# Altium project Sensorbox.PrjPCB (part 2 of 2)

## Sheet GSM.SchDoc: Sheet
size 420 x 297 mm; DocumentNumber: 1; SheetNumber: 1; SheetTotal: 8
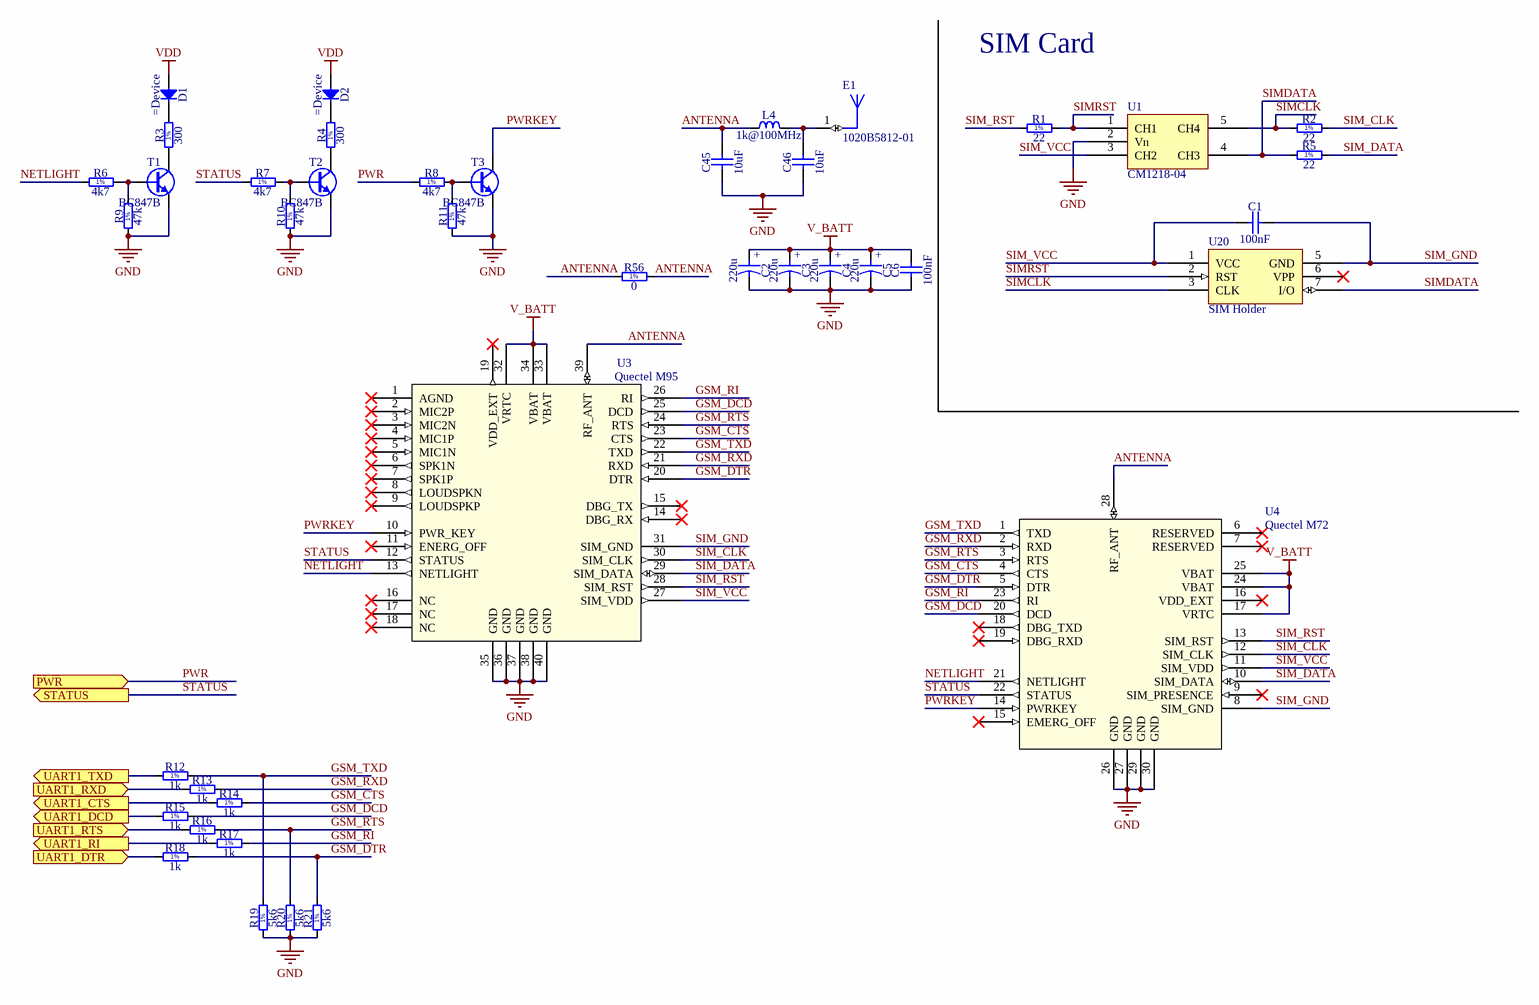
[diagram p6: GSM.SchDoc]

### Parts
C1  100nF  [CAPC1608X87N]
C2  220u  [CAPMP7343X310N]
C3  220u  [CAPMP7343X310N]
C4  220u  [CAPMP7343X310N]
C5  220u  [CAPMP7343X310N]
C6  100nF  [CAPC1608X87N]
C45  10uF  [CAPC1608X87N]
C46  10uF  [CAPC1608X87N]
D1  (no value)  [LED_DIODE_0603]
D2  (no value)  [LED_DIODE_0603]
E1  1020B5812-01  [ANT27.3X7.9]
L4  1k@100MHz  [INDC1608X100N]
R1  22  [RESC1608X55N]
R2  22  [RESC1608X55N]
R3  300  [RESC1608X55N]
R4  300  [RESC1608X55N]
R5  22  [RESC1608X55N]
R6  4k7  [RESC1608X55N]
R7  4k7  [RESC1608X55N]
R8  4k7  [RESC1608X55N]
R9  47k  [RESC1608X55N]
R10  47k  [RESC1608X55N]
R11  47k  [RESC1608X55N]
R12  1k  [RESC1608X55N]
R13  1k  [RESC1608X55N]
R14  1k  [RESC1608X55N]
R15  1k  [RESC1608X55N]
R16  1k  [RESC1608X55N]
R17  1k  [RESC1608X55N]
R18  1k  [RESC1608X55N]
R19  5k6  [RESC1608X55N]
R20  5k6  [RESC1608X55N]
R21  5k6  [RESC1608X55N]
R56  0  [RESC1608X55N]
T1  BC847B  [SOT95P230X110-3N]
T2  BC847B  [SOT95P230X110-3N]
T3  BC847B  [SOT95P230X110-3N]
U1  CM1218-04  [ESD PROTECTOR]
U3  Quectel M95  [QUECTEL M95]
U4  Quectel M72  [Quectel M72 GSM Module]
U20  SIM Holder  [CARD-SIMEE8C15]

### Ports
PWR (in), STATUS (out), UART1_CTS (out), UART1_DCD (out), UART1_DTR (in), UART1_RI (out), UART1_RTS (in), UART1_RXD (in), UART1_TXD (out)

### Nets
GND: C2.2 C3.2 C4.2 C5.2 C6.1 C45.1 C46.1 R9.1 R10.1 R11.1 R19.1 R20.1 R21.1 T1.2(E) T2.2(E) T3.2(E) U1.2(Vn) U3.35(GND) U3.36(GND) U3.37(GND) U3.38(GND) U3.40(GND) U4.26(GND) U4.27(GND) U4.29(GND) U4.30(GND)
V_BATT: C2.1 C3.1 C4.1 C5.1 C6.2 U3.32(VRTC) U3.33(VBAT) U3.34(VBAT) U4.17(VRTC) U4.24(VBAT) U4.25(VBAT)
VDD: D1.2(A) D2.2(A)
ANTENNA: C45.2 L4.1 R56.1 R56.2 U3.39(RF_ANT) U4.28(RF_ANT)
GSM_1: R12.1 ; port UART1_TXD
GSM_2: R13.1 ; port UART1_RXD
GSM_3: R14.1 ; port UART1_CTS
GSM_4: R15.1 ; port UART1_DCD
GSM_5: R17.1 ; port UART1_RI
GSM_6: R18.1 ; port UART1_DTR
GSM_7: R16.1 ; port UART1_RTS
GSM_CTS: R14.2 U3.23(CTS) U4.4(CTS)
GSM_DCD: R15.2 U3.25(DCD) U4.20(DCD)
GSM_DTR: R18.2 R21.2 U3.20(DTR) U4.5(DTR)
GSM_RI: R17.2 U3.26(RI) U4.23(RI)
GSM_RTS: R16.2 R20.2 U3.24(RTS) U4.3(RTS)
GSM_RXD: R13.2 U3.21(RXD) U4.2(RXD)
GSM_TXD: R12.2 R19.2 U3.22(TXD) U4.1(TXD)
NETLIGHT: R6.1 U3.13(NETLIGHT) U4.21(NETLIGHT)
PWR: R8.1 ; port PWR  [project net GSM_8]
PWRKEY: T3.3(C) U3.10(PWR_KEY) U4.14(PWRKEY)
SIM_CLK: R2.2 U3.30(SIM_CLK) U4.12(SIM_CLK)
SIM_DATA: R5.2 U3.29(SIM_DATA) U4.10(SIM_DATA)
SIM_GND: C1.2 U3.31(SIM_GND) U4.8(SIM_GND) U20.5(GND)
SIM_RST: R1.1 U3.28(SIM_RST) U4.13(SIM_RST)
SIM_VCC: C1.1 U1.3(CH2) U3.27(SIM_VDD) U4.11(SIM_VDD) U20.1(VCC)
SIMCLK: R2.1 U1.5(CH4) U20.3(CLK)
SIMDATA: R5.1 U1.4(CH3) U20.7(I/O)
SIMRST: R1.2 U1.1(CH1) U20.2(RST)
STATUS: R7.1 U3.12(STATUS) U4.22(STATUS) ; port STATUS  [project net GSM_9]
NetC46_2: C46.2 E1.1(FEED) L4.2
NetD1_1: D1.1(C) R3.2
NetD2_1: D2.1(C) R4.2
NetR3_1: R3.1 T1.3(C)
NetR4_1: R4.1 T2.3(C)
NetR6_2: R6.2 R9.2 T1.1(B)
NetR7_2: R7.2 R10.2 T2.1(B)
NetR8_2: R8.2 R11.2 T3.1(B)

Not connected (* = marked no-connect by the designer): U3 1(AGND)* 2(MIC2P)* 3(MIC2N)* 4(MIC1P)* 5(MIC1N)* 6(SPK1N)* 7(SPK1P)* 8(LOUDSPKN)* 9(LOUDSPKP)* 11(ENERG_OFF)* 14(DBG_RX)* 15(DBG_TX)* 16(NC)* 17(NC)* 18(NC)* 19(VDD_EXT)*; U4 6(RESERVED)* 7(RESERVED)* 9(SIM_PRESENCE)* 15(EMERG_OFF)* 16(VDD_EXT)* 18(DBG_TXD)* 19(DBG_RXD)*; U20 6(VPP)*

### Notes on the sheet
- SIM Card
- Project/Equipment
- Document
- Sensorbox
- Designer
- Drawn by
- Check.by
- Copyright Creotech Instruments SA 2014.
  This documentation describes Open Hardware and is licensed under the CERN OHL v.1.1. You may redistribute and modify this documentation under the terms of the CERN OHL v.1.1. (http://ohwr.org/CERNOHL). This documentation is distributed WITHOUT ANY EXPRESS OR IMPLIED WARRANTY, INCLUDING OF MERCHANTABILITY, SATISFACTORY QUALITY AND FITNESS FOR A PARTICULAR PURPOSE. Please see the CERN OHL v.1.1 for applicable conditions.
- CTI
- Creotech Instruments S.A.
- File
- Last Mod.
- Print Date
- Sheet
- Size
- A3
- of
- Rev
- (in symbol Capacitor - polarized) +
- (in symbol R0603_0R_JUMPER) 1%
- (in symbol R0603_1K_1%_0.1W_100PPM) 1%
- (in symbol R0603_4K7_1%_0.1W_100PPM) 1%
- (in symbol R0603_5K6_1%_0.1W_100PPM) 1%
- (in symbol R0603_22R_1%_0.1W_100PPM) 1%
- (in symbol R0603_47K_1%_0.1W_100PPM) 1%
- (in symbol R0603_300R_1%_0.1W_100PPM) 1%

### Library data of the parts
C1 C6 = CC0603_100NF_50V_10%_X7R: Non-polarised capacitor; Part Description: SMD Multilayer Chip Ceramic Capacitor; Manufacturer: GENERIC; Manufacturer1 Part Number: 223858615649; Voltage: 50V; TC: X7R; Tolerance: ±10%; Table: Capacitors SMD; Part Number: CC0603_100NF_50V_10%_X7R; Component Kind: Standard; Component Type: Standard; Pin Count: 2; Value: 100nF; Status: Preferred; Manufacturer Part Number: CC0603_100NF_50V_10%_X7R; Case: 0603; Mounted: Yes; Socket: No; SMD: Yes; Manufacturer1 Example: PHYCOMP; Manufacturer1 ComponentHeight: 0.87mm; HelpURL: \\cern.ch\dfs\Applications\Altium\Datasheets\CC0603_X7R_PHYCOMP.pdf; Author: CERN DEM JLC; CreateDate: 2007-12-03; LatestRevisionDate: 2007-12-03
C2-C5 = Capacitor - polarized: KEMET T530D
C45 C46 = CC0603_10UF_6.3V_20%_X5R: Non-polarised capacitor; Part Description: SMD Multilayer Chip Ceramic Capacitor; Manufacturer: GENERIC; Manufacturer1 Part Number: C0603C106M9PAC; Voltage: 6.3V; TC: X5R; Tolerance: ±20%; Table: Capacitors SMD; Part Number: CC0603_10UF_6.3V_20%_X5R; Component Kind: Standard; Component Type: Standard; Pin Count: 2; Value: 10uF; Status: Preferred; Manufacturer Part Number: CC0603_10uF_6.3V_20%_X5R; Case: 0603; Mounted: Yes; Socket: No; SMD: Yes; Manufacturer1 Example: KEMET; Manufacturer1 ComponentHeight: 0.95mm; HelpURL: \\cern.ch\dfs\Applications\Altium\Datasheets\CC0603_X5R_KEMET.pdf; Author: CERN DEM JLC; CreateDate: 2007-12-03; LatestRevisionDate: 2007-12-03
D1 D2 = Diode
E1 = 1020B5812-01: Flavus GSM Snap-In Antenna, 800/900/1800/1900 MHz, 0.8mm PCB Thickness; PCB_Layout: Complies with manufacturer's recommendation.; Published: 30-May-2008; DatasheetVersion: AE030090-C; PackageVersion: Feb-2007; PackageReference: ANT27.3X7.9; Publisher: Altium Limited; PackageDescription: Snap-In Antenna, Plastic; Body 27.3 x 7.9 mm (LxW); ComponentLink1Description: Manufacturer Link; ComponentLink1URL: http://www.antenova.com/; ComponentLink2Description: Datasheet; ComponentLink2URL: http://www.antenova.com/?id=855&pv=1&lang=1
L4 = IND0603_WURTH_74279266: Inductor; Part Description: SMD EMI Suppression Chip Bead Ferrite (WE-CBF Serie); Manufacturer: WURTH ELEKTRONIK; Power: 200mA; Resistance: 0.6R; Tolerance: ±25%; Table: Inductors SMD; Part Number: IND0603_WURTH_74279266; Component Kind: Standard; Component Type: Standard; Pin Count: 2; Value: 1k@100MHz; Status: None; Manufacturer Part Number: 74279266; Case: 0603; Mounted: Yes; Socket: No; SMD: Yes; ComponentHeight: 1mm; HelpURL: \\cern.ch\dfs\Applications\Altium\Datasheets\IND0603_WURTH_74279266.pdf; Author: CERN DEM JLC; CreateDate: 2011-03-08; LatestRevisionDate: 2011-03-08
R1 R2 R5 = R0603_22R_1%_0.1W_100PPM: Resistor - 1%; Part Description: General Purpose Thick Film Chip Resistor; Manufacturer: GENERIC; Manufacturer1 Part Number: NRC06F22R0TRF; Power: 0.1W; TC: ±100ppm/°C; Table: Resistors SMD; Part Number: R0603_22R_1%_0.1W_100PPM; Component Kind: Standard; Component Type: Standard; Pin Count: 2; Value: 22; Status: Preferred; Tolerance: ±1%; Manufacturer Part Number: R0603_22R_1%_0.1W_100PPM; Case: 0603; Mounted: Yes; Socket: No; SMD: Yes; Manufacturer1 Example: NIC COMPONENT; Manufacturer1 ComponentHeight: 0.55mm; HelpURL: \\cern.ch\dfs\Applications\Altium\Datasheets\R0603_NIC_NRC.pdf; Author: CERN DEM JLC; CreateDate: 2007-12-03; LatestRevisionDate: 2008-03-13
R3 R4 = R0603_300R_1%_0.1W_100PPM: Resistor - 1%; Part Description: General Purpose Thick Film Chip Resistor; Manufacturer: GENERIC; Manufacturer1 Part Number: NRC06F3000TRF; Power: 0.1W; TC: ±100ppm/°C; Table: Resistors SMD; Part Number: R0603_300R_1%_0.1W_100PPM; Component Kind: Standard; Component Type: Standard; Pin Count: 2; Value: 300; Status: Preferred; Tolerance: ±1%; Manufacturer Part Number: R0603_300R_1%_0.1W_100PPM; Case: 0603; Mounted: Yes; Socket: No; SMD: Yes; Manufacturer1 Example: NIC COMPONENT; Manufacturer1 ComponentHeight: 0.55mm; HelpURL: \\cern.ch\dfs\Applications\Altium\Datasheets\R0603_NIC_NRC.pdf; Author: CERN DEM JLC; CreateDate: 2007-12-03; LatestRevisionDate: 2008-03-13
R6-R8 = R0603_4K7_1%_0.1W_100PPM: Resistor - 1%; Part Description: General Purpose Thick Film Chip Resistor; Manufacturer: GENERIC; Manufacturer1 Part Number: NRC06F4701TRF; Power: 0.1W; TC: ±100ppm/°C; Table: Resistors SMD; Part Number: R0603_4K7_1%_0.1W_100PPM; Component Kind: Standard; Component Type: Standard; Pin Count: 2; Value: 4k7; Status: Preferred; Tolerance: ±1%; Manufacturer Part Number: R0603_4K7_1%_0.1W_100PPM; Case: 0603; Mounted: Yes; Socket: No; SMD: Yes; Manufacturer1 Example: NIC COMPONENT; Manufacturer1 ComponentHeight: 0.55mm; HelpURL: \\cern.ch\dfs\Applications\Altium\Datasheets\R0603_NIC_NRC.pdf; Author: CERN DEM JLC; CreateDate: 2007-12-03; LatestRevisionDate: 2008-03-13
R9-R11 = R0603_47K_1%_0.1W_100PPM: Resistor - 1%; Part Description: General Purpose Thick Film Chip Resistor; Manufacturer: GENERIC; Manufacturer1 Part Number: NRC06F4702TRF; Power: 0.1W; TC: ±100ppm/°C; Table: Resistors SMD; Part Number: R0603_47K_1%_0.1W_100PPM; Component Kind: Standard; Component Type: Standard; Pin Count: 2; Value: 47k; Status: Preferred; Tolerance: ±1%; Manufacturer Part Number: R0603_47K_1%_0.1W_100PPM; Case: 0603; Mounted: Yes; Socket: No; SMD: Yes; Manufacturer1 Example: NIC COMPONENT; Manufacturer1 ComponentHeight: 0.55mm; HelpURL: \\cern.ch\dfs\Applications\Altium\Datasheets\R0603_NIC_NRC.pdf; Author: CERN DEM JLC; CreateDate: 2007-12-03; LatestRevisionDate: 2008-03-13
R12-R18 = R0603_1K_1%_0.1W_100PPM: Resistor - 1%; Part Description: General Purpose Thick Film Chip Resistor; Manufacturer: GENERIC; Manufacturer1 Part Number: NRC06F1001TRF; Power: 0.1W; TC: ±100ppm/°C; Table: Resistors SMD; Part Number: R0603_1K_1%_0.1W_100PPM; Component Kind: Standard; Component Type: Standard; Pin Count: 2; Value: 1k; Status: Preferred; Tolerance: ±1%; Manufacturer Part Number: R0603_1K_1%_0.1W_100PPM; Case: 0603; Mounted: Yes; Socket: No; SMD: Yes; Manufacturer1 Example: NIC COMPONENT; Manufacturer1 ComponentHeight: 0.55mm; HelpURL: \\cern.ch\dfs\Applications\Altium\Datasheets\R0603_NIC_NRC.pdf; Author: CERN DEM JLC; CreateDate: 2007-12-03; LatestRevisionDate: 2008-03-13
R19-R21 = R0603_5K6_1%_0.1W_100PPM: Resistor - 1%; Part Description: General Purpose Thick Film Chip Resistor; Manufacturer: GENERIC; Manufacturer1 Part Number: NRC06F5601TRF; Power: 0.1W; TC: ±100ppm/°C; Table: Resistors SMD; Part Number: R0603_5K6_1%_0.1W_100PPM; Component Kind: Standard; Component Type: Standard; Pin Count: 2; Value: 5k6; Status: Preferred; Tolerance: ±1%; Manufacturer Part Number: R0603_5K6_1%_0.1W_100PPM; Case: 0603; Mounted: Yes; Socket: No; SMD: Yes; Manufacturer1 Example: NIC COMPONENT; Manufacturer1 ComponentHeight: 0.55mm; HelpURL: \\cern.ch\dfs\Applications\Altium\Datasheets\R0603_NIC_NRC.pdf; Author: CERN DEM JLC; CreateDate: 2007-12-03; LatestRevisionDate: 2008-03-13
R56 = R0603_0R_JUMPER: Resistor - 1%; Part Description: 1A (0.05R Max DC Resistance) Zero Ohm Jumper; Manufacturer: GENERIC; Manufacturer1 Part Number: NRC06Z0; Table: Resistors SMD; Part Number: R0603_0R_JUMPER; Component Kind: Standard; Component Type: Standard; Pin Count: 2; Value: 0; Status: Preferred; Manufacturer Part Number: R0603_0R_JUMPER; Case: 0603; Mounted: Yes; Socket: No; SMD: Yes; Manufacturer1 Example: NIC COMPONENT; Manufacturer1 ComponentHeight: 0.55mm; HelpURL: \\cern.ch\dfs\Applications\Altium\Datasheets\R0603_NIC_NRC.pdf; Author: CERN DEM JLC; CreateDate: 2007-12-03; LatestRevisionDate: 2008-03-13
T1-T3 = BC847B: NPN Transistor; Part Description: 45V, 100mA NPN general-purpose transistors; Manufacturer: NXP SEMICONDUCTORS; Table: Transistors; Part Number: BC847B; Component Kind: Standard; Component Type: Standard; Device: BC847B; PackageDescription: SOT23, 3 pin, Pitch 0.95mm - 1.3mm W X 2.9mm L X 1.1mm H, IPC Medium Density; Manufacturer Part Number: BC847B; Pin Count: 3; Case: SOT23-3; Mounted: Yes; Socket: No; SMD: Yes; ComponentHeight: 1.1mm; HelpURL: \\cern.ch\dfs\Applications\Altium\Datasheets\BC847B.pdf; Author: CERN DEM JLC; CreateDate: 2011-06-14; LatestRevisionDate: 2011-06-14
U1 = CM1218-04 ESD_Protector SOT23-5 Package: ESD_Protector SOT23-5 Package
U3 = Quectel M95: GSM Module
U4 = Quectel M72: GSM Module
U20 = SIM Holder: 6-pin SIM Holder

## Sheet Display.SchDoc: Display
size 420 x 297 mm; DocumentNumber: 8; SheetNumber: 8; SheetTotal: 8
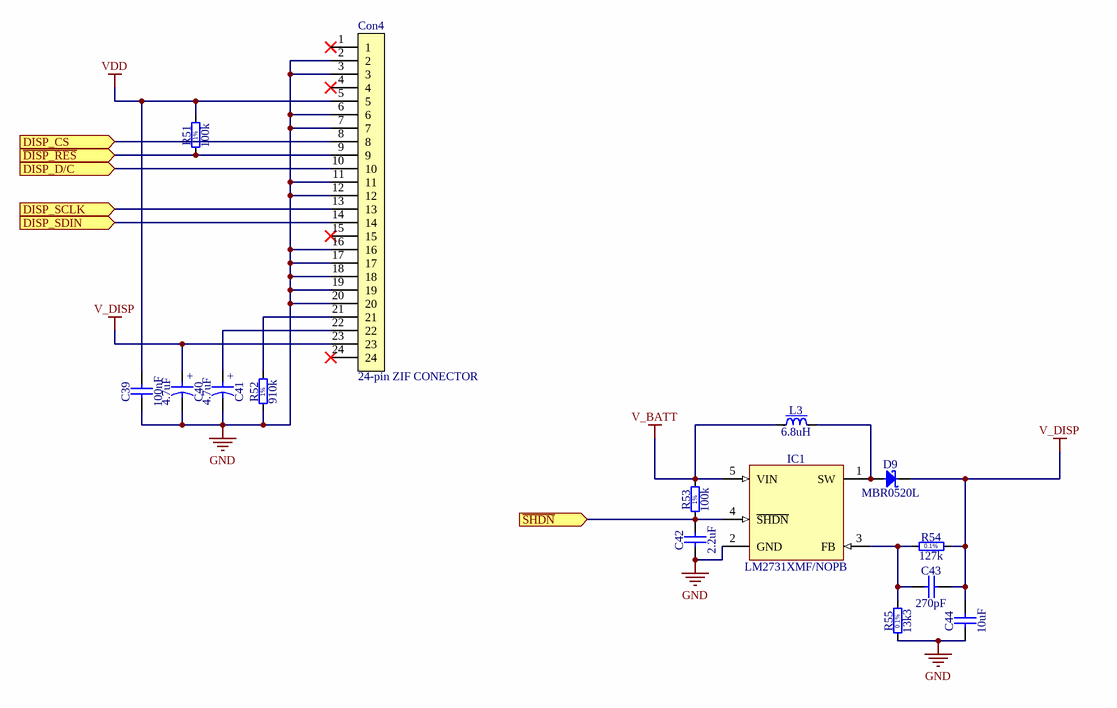
[diagram p7: Display.SchDoc]

### Parts
C39  100nF  [CAPC1608X87N]
C40  4.7uF  [CAPMP3216X180N]
C41  4.7uF  [CAPMP3216X180N]
C42  2.2uF  [CAPC1608X90N]
C43  270pF  [CAPC1608X87N]
C44  10uF  [CAPC1608X87N]
Con4  24-pin ZIF CONECTOR  [CviLux CF20 ZIFNZ0224CV]
D9  MBR0520L  [SOD3816X118N]
IC1  LM2731XMF/NOPB  [SOT95P284X122-5N]
L3  6.8uH  [IND_COILCRAFT_DO3316]
R51  100k  [RESC1608X55N]
R52  910k  [RESC1608X55N]
R53  100k  [RESC1608X55N]
R54  127k  [RESC1608X55N]
R55  13k3  [RESC1608X55N]

### Ports
DISP_CS (in), DISP_D/C (in), DISP_SCLK (in), DISP_SDIN (in), ~{DISP_RES} (in), ~{SHDN} (in)

### Nets
GND: C39.1 C40.2 C41.2 C42.1 C44.1 Con4.2 Con4.3 Con4.6 Con4.7 Con4.11 Con4.12 Con4.16 Con4.17 Con4.18 Con4.19 Con4.20 IC1.2(GND) R52.1 R55.1
V_BATT: IC1.5(VIN) L3.1 R53.2
V_DISP: C40.1 C43.2 C44.2 Con4.23 D9.1(C) R54.2
VDD: C39.2 Con4.5 R51.2
NetC41_1: C41.1 Con4.22
NetC42_2: C42.2 IC1.4(~{SHDN}) R53.1 ; port ~{SHDN}
NetC43_1: C43.1 IC1.3(FB) R54.1 R55.2
NetCon4_8: Con4.8 ; port DISP_CS
NetCon4_9: Con4.9 R51.1 ; port ~{DISP_RES}
NetCon4_10: Con4.10 ; port DISP_D/C
NetCon4_13: Con4.13 ; port DISP_SCLK
NetCon4_14: Con4.14 ; port DISP_SDIN
NetCon4_21: Con4.21 R52.2
NetD9_2: D9.2(A) IC1.1(SW) L3.2

Not connected (* = marked no-connect by the designer): Con4 1* 4* 15* 24*

### Notes on the sheet
- Project/Equipment
- Document
- Sensorbox
- Designer
- Drawn by
- Check.by
- Copyright Creotech Instruments SA 2014.
  This documentation describes Open Hardware and is licensed under the CERN OHL v.1.1. You may redistribute and modify this documentation under the terms of the CERN OHL v.1.1. (http://ohwr.org/CERNOHL). This documentation is distributed WITHOUT ANY EXPRESS OR IMPLIED WARRANTY, INCLUDING OF MERCHANTABILITY, SATISFACTORY QUALITY AND FITNESS FOR A PARTICULAR PURPOSE. Please see the CERN OHL v.1.1 for applicable conditions.
- CTI
- Creotech Instruments S.A.
- File
- Last Mod.
- Print Date
- Sheet
- Size
- A3
- of
- Rev
- (in symbol CTE3216-18_4.7UF_10V_10%_LESR1400) +
- (in symbol R0603_13K3_0.1%_0.063W_10PPM) 0.1%
- (in symbol R0603_100K_1%_0.1W_100PPM) 1%
- (in symbol R0603_127K_0.1%_0.063W_10PPM) 0.1%
- (in symbol R0603_910K_1%_0.1W_100PPM) 1%

### Library data of the parts
C39 = CC0603_100NF_50V_10%_X7R: as C1 on sheet GSM; Part Number: CC0603_100NF_50V_10%_X7R; Component Kind: Standard; Component Type: Standard; Pin Count: 2; Value: 100nF; Status: Preferred; Manufacturer Part Number: CC0603_100NF_50V_10%_X7R; Case: 0603; Mounted: Yes; Socket: No; SMD: Yes; Manufacturer1 Example: PHYCOMP; Manufacturer1 ComponentHeight: 0.87mm; HelpURL: \\cern.ch\dfs\Applications\Altium\Datasheets\CC0603_X7R_PHYCOMP.pdf; Author: CERN DEM JLC; CreateDate: 2007-12-03; LatestRevisionDate: 2007-12-03
C40 C41 = CTE3216-18_4.7UF_10V_10%_LESR1400: Polarised capacitor; Part Number: 4.7UF_16V_10%_LESR1400; Part Description: Low ESR 1R4 Solid Tantalum Chip Capacitor; Manufacturer: GENERIC; Manufacturer1 Part Number: TPSA475K010R1400; Voltage: 16V; Tolerance: ±10%; Table: Capacitors SMD; Component Kind: Standard; Component Type: Standard; Pin Count: 2; Value: 4.7uF; Status: Preferred; Manufacturer Part Number: 4.7UF_16V_10%_LESR1400; Case: A; Mounted: Yes; Socket: No; SMD: Yes; Manufacturer1 Example: AVX; Manufacturer1 ComponentHeight: 1.8mm; HelpURL: \\cern.ch\dfs\Applications\Altium\Datasheets\CTE-LESR_AVX_TPS.pdf; Author: CERN DEM JLC; CreateDate: 2008-05-05; LatestRevisionDate: 2009-01-20
C42 = CC0603_2.2UF_10V_20%_X7R: Non-polarised capacitor; Part Description: SMD Multilayer Chip Ceramic Capacitor; Manufacturer: GENERIC; Manufacturer1 Part Number: LMK107B7225MA-T; Voltage: 10V; TC: X7R; Tolerance: ±20%; Table: Capacitors SMD; Part Number: CC0603_2.2UF_10V_20%_X7R; Component Kind: Standard; Component Type: Standard; Pin Count: 2; Value: 2.2uF; Status: Not Recommended; Manufacturer Part Number: CC0603_2.2UF_10V_20%_X7R; Case: 0603; Mounted: Yes; Socket: No; SMD: Yes; Manufacturer1 Example: TAIYO YUDEN; Manufacturer1 ComponentHeight: 0.9mm; HelpURL: \\cern.ch\dfs\Applications\Altium\Datasheets\CC0603_X7R_TAIYO-YUDEN_HIGH-VALUE.pdf; Author: CERN DEM JLC; CreateDate: 2011-06-22; LatestRevisionDate: 2011-06-27
C43 = CC0603_270PF_50V_5%_NP0: Non-polarised capacitor; Part Description: SMD Multilayer Chip Ceramic Capacitor; Manufacturer: GENERIC; Manufacturer1 Part Number: 223886715271; Voltage: 50V; TC: NP0; Tolerance: ±5%; Table: Capacitors SMD; Part Number: CC0603_270PF_50V_5%_NP0; Component Kind: Standard; Component Type: Standard; Pin Count: 2; Value: 270pF; Status: Preferred; Manufacturer Part Number: CC0603_270PF_50V_5%_NP0; Case: 0603; Mounted: Yes; Socket: No; SMD: Yes; Manufacturer1 Example: PHYCOMP; Manufacturer1 ComponentHeight: 0.87mm; HelpURL: \\cern.ch\dfs\Applications\Altium\Datasheets\CC0603_NP0_PHYCOMP.pdf; Author: CERN DEM JLC; CreateDate: 2007-12-03; LatestRevisionDate: 2007-12-03
C44 = CC0603_10UF_6.3V_20%_X5R: as C45 on sheet GSM; Part Number: CC0603_10UF_6.3V_20%_X5R; Component Kind: Standard; Component Type: Standard; Pin Count: 2; Value: 10uF; Status: Preferred; Manufacturer Part Number: CC0603_10uF_6.3V_20%_X5R; Case: 0603; Mounted: Yes; Socket: No; SMD: Yes; Manufacturer1 Example: KEMET; Manufacturer1 ComponentHeight: 0.95mm; HelpURL: \\cern.ch\dfs\Applications\Altium\Datasheets\CC0603_X5R_KEMET.pdf; Author: CERN DEM JLC; CreateDate: 2007-12-03; LatestRevisionDate: 2007-12-03
Con4 = ZIFNZ0224CV CviLux CF20: 24-pin ZIF Male Down Side Connector
D9 = MBR0520L: Schottky Diode; Part Description: Schottky Power Rectifier; Manufacturer: FAIRCHILD SEMICONDUCTOR; Voltage: 20V; Power: 0.5A; Table: Diodes; Part Number: MBR0520L; Component Kind: Standard; Component Type: Standard; Device: MBR0520L; PackageDescription: SOD Diode (SOD-123); 2.70mm W X 1.60mm L X 1.18mm H body, IPC Medium Density; Manufacturer Part Number: MBR0520L; Pin Count: 2; Case: SOD-123; Mounted: Yes; Socket: No; SMD: Yes; ComponentHeight: 1.18mm; HelpURL: \\cern.ch\dfs\Applications\Altium\Datasheets\MBR0520L.pdf; Author: CERN DEM JLC; CreateDate: 2009-11-25; LatestRevisionDate: 2009-11-25
IC1 = LM2731YMF/NOPB: 0.0.6MHz Boost Converters With 22V Internal FET Switch; Part Description: 2.7V-14V, 1.8A, 0.6MHz Boost Converters With 22V Internal FET Switch; Manufacturer: NATIONAL SEMICONDUCTOR; Table: Regulators; Part Number: LM2731XMF/NOPB; Component Kind: Standard; Component Type: Standard; Device: LM2731XMF/NOPB; PackageDescription: SOT23 5, Pitch 0.95mm - Body 1.67x2.99mm, IPC Medium Density; Manufacturer Part Number: LM2731YMF/NOPB; Pin Count: 5; Case: SOT23-5; Mounted: Yes; Socket: No; SMD: Yes; ComponentHeight: 1.19mm; HelpURL: \\cern.ch\dfs\Applications\Altium\Datasheets\LM2731YMF-NOPB.pdf; Author: CERN DEM JLC; CreateDate: 2011-09-26; LatestRevisionDate: 2011-09-26
L3 = IND_6.8UH_20%_COILCRAFT_DO3316P-682MLD: Inductor With Magnetic core; Part Description: SMT Power Inductors; Power: 4.4A; Resistance: 0.027R; Tolerance: ±20%; Table: Inductors SMD; Part Number: IND_6.8UH_20%_COILCRAFT_DO3316P-682MLD; Component Kind: Standard; Component Type: Standard; Pin Count: 2; Value: 6.8uH; Status: None; Manufacturer: COILCRAFT; Manufacturer Part Number: DO3316P-682MLD; Mounted: Yes; Socket: No; SMD: Yes; ComponentHeight: 5.21mm; HelpURL: \\cern.ch\dfs\Applications\Altium\Datasheets\IND_COILCRAFT_DO3316P.pdf; Author: CERN DEM JLC; CreateDate: 2008-06-26; LatestRevisionDate: 2010-02-17
R51 R53 = R0603_100K_1%_0.1W_100PPM: Resistor - 1%; Part Description: General Purpose Thick Film Chip Resistor; Manufacturer: GENERIC; Manufacturer1 Part Number: NRC06F1003TRF; Power: 0.1W; TC: ±100ppm/°C; Table: Resistors SMD; Part Number: R0603_100K_1%_0.1W_100PPM; Component Kind: Standard; Component Type: Standard; Pin Count: 2; Value: 100k; Status: Preferred; Tolerance: ±1%; Manufacturer Part Number: R0603_100K_1%_0.1W_100PPM; Case: 0603; Mounted: Yes; Socket: No; SMD: Yes; Manufacturer1 Example: NIC COMPONENT; Manufacturer1 ComponentHeight: 0.55mm; HelpURL: \\cern.ch\dfs\Applications\Altium\Datasheets\R0603_NIC_NRC.pdf; Author: CERN DEM JLC; CreateDate: 2007-12-03; LatestRevisionDate: 2008-03-13
R52 = R0603_910K_1%_0.1W_100PPM: Resistor - 1%; Part Description: General Purpose Thick Film Chip Resistor; Manufacturer: GENERIC; Manufacturer1 Part Number: NRC06F9103TRF; Power: 0.1W; TC: ±100ppm/°C; Table: Resistors SMD; Part Number: R0603_910K_1%_0.1W_100PPM; Component Kind: Standard; Component Type: Standard; Pin Count: 2; Value: 910k; Status: Preferred; Tolerance: ±1%; Manufacturer Part Number: R0603_910K_1%_0.1W_100PPM; Case: 0603; Mounted: Yes; Socket: No; SMD: Yes; Manufacturer1 Example: NIC COMPONENT; Manufacturer1 ComponentHeight: 0.55mm; HelpURL: \\cern.ch\dfs\Applications\Altium\Datasheets\R0603_NIC_NRC.pdf; Author: CERN DEM JLC; CreateDate: 2007-12-03; LatestRevisionDate: 2008-03-13
R54 = R0603_127K_0.1%_0.063W_10PPM: Resistor - 0.1%; Part Description: Thin Film Chip Resistor; Manufacturer: GENERIC; Manufacturer1 Part Number: RN73C1J127KBTDF; Power: 0.063W; TC: ±10ppm; Table: Resistors SMD; Part Number: R0603_127K_0.1%_0.063W_10PPM; Component Kind: Standard; Component Type: Standard; Pin Count: 2; Value: 127k; Status: Not recommended; Tolerance: ±0.1%; Manufacturer Part Number: R0603_127K_0.1%_0.063W_10PPM; Case: 0603; Mounted: Yes; Socket: No; SMD: Yes; Manufacturer1 Example: TYCO HOLSWORTHY; Manufacturer1 ComponentHeight: 0.5mm; HelpURL: \\cern.ch\dfs\Applications\Altium\Datasheets\R0603_Tyco_RN73.pdf; Author: CERN DEM JLC; CreateDate: 2007-12-03; LatestRevisionDate: 2008-03-13
R55 = R0603_13K3_0.1%_0.063W_10PPM: Resistor - 0.1%; Part Description: Thin Film Chip Resistor; Manufacturer: GENERIC; Manufacturer1 Part Number: RN73C1J13K3BTDF; Power: 0.063W; TC: ±10ppm; Table: Resistors SMD; Part Number: R0603_13K3_0.1%_0.063W_10PPM; Component Kind: Standard; Component Type: Standard; Pin Count: 2; Value: 13k3; Status: Not recommended; Tolerance: ±0.1%; Manufacturer Part Number: R0603_13K3_0.1%_0.063W_10PPM; Case: 0603; Mounted: Yes; Socket: No; SMD: Yes; Manufacturer1 Example: TYCO HOLSWORTHY; Manufacturer1 ComponentHeight: 0.5mm; HelpURL: \\cern.ch\dfs\Applications\Altium\Datasheets\R0603_Tyco_RN73.pdf; Author: CERN DEM JLC; CreateDate: 2007-12-03; LatestRevisionDate: 2008-03-13

## Nets that join several sheets
GND: Supply (24 pins), RJ-50 (10 pins), MUX (8 pins), MCU_CONTROL (32 pins), GPS (8 pins), GSM (26 pins), Display (19 pins)
V_BATT: Supply (5 pins), MCU_CONTROL (R22.2), GSM (11 pins), Display (IC1.5 L3.1 R53.2)
VDD: Supply (5 pins), RJ-50 (6 pins), MUX (8 pins), MCU_CONTROL (25 pins), GPS (L2.1 U19.4), GSM (D1.2 D2.2), Display (C39.2 Con4.5 R51.2)
GSM_1: MCU_CONTROL (U5.59), GSM (R12.1)
GSM_2: MCU_CONTROL (U5.60), GSM (R13.1)
GSM_3: MCU_CONTROL (U5.58), GSM (R14.1)
GSM_4: MCU_CONTROL (U5.55), GSM (R15.1)
GSM_5: MCU_CONTROL (U5.52), GSM (R17.1)
GSM_6: MCU_CONTROL (U5.53), GSM (R18.1)
GSM_7: MCU_CONTROL (U5.51), GSM (R16.1)
GSM_8: MCU_CONTROL (U5.50), GSM (R8.1)
GSM_9: MCU_CONTROL (U5.49), GSM (R7.1 U3.12 U4.22)
MUX_1: RJ-50 (RN1.8 U10.3), MUX (U6.12)
MUX_2: RJ-50 (RN1.7 U10.4), MUX (U6.1)
MUX_3: RJ-50 (RN1.6 U10.5), MUX (U7.12)
MUX_4: RJ-50 (RN1.5 U11.1), MUX (U7.1)
MUX_5: RJ-50 (RN2.8 U11.3), MUX (U8.12)
MUX_6: RJ-50 (RN2.5 U13.1), MUX (U8.1)
MUX_7: RJ-50 (RN2.7 U11.4), MUX (U9.12)
MUX_8: RJ-50 (RN2.6 U11.5), MUX (U9.1)
MUX_9: RJ-50 (RN3.8 U13.4), MUX (U6.14)
MUX_10: RJ-50 (RN3.7 U13.5), MUX (U6.5)
MUX_11: RJ-50 (RN3.6 U12.1), MUX (U7.14)
MUX_12: RJ-50 (RN3.5 U12.3), MUX (U7.5)
MUX_13: RJ-50 (RN4.8 U12.4), MUX (U8.14)
MUX_14: RJ-50 (RN4.5 U14.3), MUX (U8.5)
MUX_15: RJ-50 (RN4.7 U12.5), MUX (U9.14)
MUX_16: RJ-50 (RN4.6 U14.1), MUX (U9.5)
MUX_17: RJ-50 (RN5.8 U14.4), MUX (U6.15)
MUX_18: RJ-50 (RN5.7 U15.1), MUX (U6.2)
MUX_19: RJ-50 (RN5.6 U15.3), MUX (U7.15)
MUX_20: RJ-50 (RN5.5 U15.4), MUX (U7.2)
MUX_21: RJ-50 (RN6.8 U15.5), MUX (U8.15)
MUX_22: RJ-50 (RN6.5 U16.4), MUX (U8.2)
MUX_23: RJ-50 (RN6.7 U16.1), MUX (U9.15)
MUX_24: RJ-50 (RN6.6 U16.3), MUX (U9.2)
MUX_ADC: MUX (U8.13), MCU_CONTROL (U5.18)
MUX_CLK: MUX (U6.3), MCU_CONTROL (U5.47)
MUX_CS: MUX (U6.13), MCU_CONTROL (U5.48)
MUX_EN: MUX (U6.6 U7.6 U8.6 U9.6), MCU_CONTROL (U5.27)
MUX_GPIO: MUX (U8.3), MCU_CONTROL (U5.44)
MUX_MISO: MUX (U7.13), MCU_CONTROL (U5.46)
MUX_MOSI: MUX (U7.3), MCU_CONTROL (U5.45)
MUX_S0: MUX (U6.10 U7.10 U8.10 U9.10), MCU_CONTROL (U5.25)
MUX_S1: MUX (U6.9 U7.9 U8.9 U9.9), MCU_CONTROL (U5.26)
MUX_SCL: MUX (U9.13), MCU_CONTROL (R29.1 U5.40)
MUX_SDA: MUX (U9.3), MCU_CONTROL (R30.1 U5.39)
NetC42_2: MCU_CONTROL (U5.17), Display (C42.2 IC1.4 R53.1)
NetCon4_8: MCU_CONTROL (U5.63), Display (Con4.8)
NetCon4_9: MCU_CONTROL (U5.72), Display (Con4.9 R51.1)
NetCon4_10: MCU_CONTROL (U5.71), Display (Con4.10)
NetCon4_13: MCU_CONTROL (U5.64), Display (Con4.13)
NetCon4_14: MCU_CONTROL (U5.61), Display (Con4.14)
NetR48_2: MCU_CONTROL (U5.79), GPS (R48.2)
NetR49_2: MCU_CONTROL (U5.80), GPS (R49.2)
SUPP_1: Supply (J2.3), MCU_CONTROL (R31.1 R35.2)
SUPP_2: Supply (J2.2), MCU_CONTROL (R32.1 R37.2)
SUPP_3: Supply (U18.3), MCU_CONTROL (U5.30)
SUPP_4: Supply (R41.1 U18.5), MCU_CONTROL (U5.28)
SUPP_5: Supply (R42.1 U18.4), MCU_CONTROL (U5.29)